# Altium schematic sheet Main.SchDoc
size A
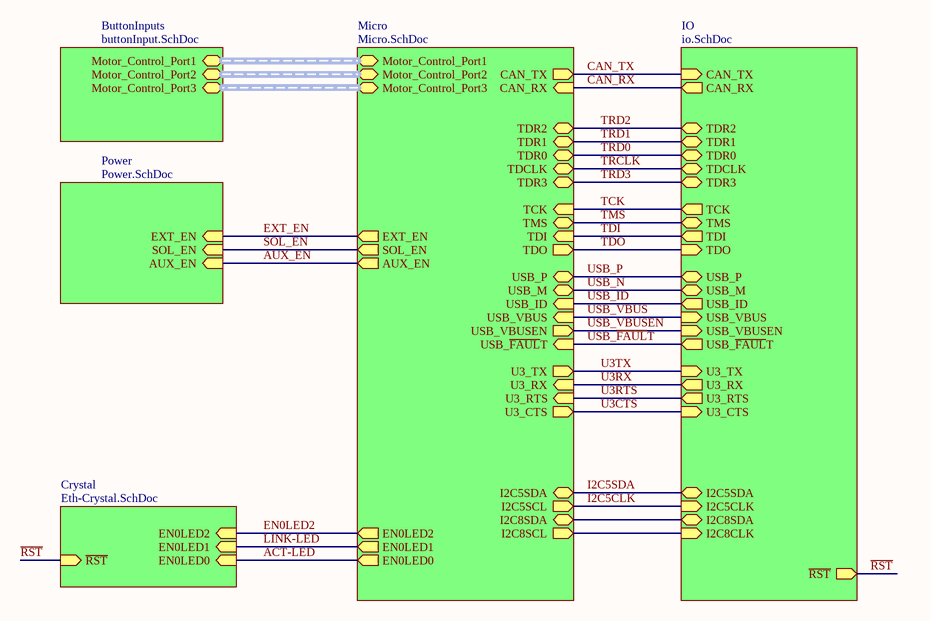
[diagram p0: Main.SchDoc]

## Sub-sheets
ButtonInputs = buttonInput.SchDoc: Motor_Control_Port1 (harness MCP), Motor_Control_Port2 (harness MCP), Motor_Control_Port3 (harness MCP)
Crystal = Eth-Crystal.SchDoc: EN0LED0 (in), EN0LED1 (in), EN0LED2 (in), ~{RST} (in)
IO = io.SchDoc: CAN_TX (in), CAN_RX (out), TCK (out), TMS (bidir), TDI (out), TDO (in), U3_RTS (out), U3_CTS (in), U3_TX (in), U3_RX (out), USB_P (bidir), USB_M (bidir), USB_ID (out), ~{RST} (out), TDR1 (bidir), TDR0 (bidir), TDR2 (bidir), TDCLK (bidir), TDR3 (bidir), I2C5SDA (bidir), I2C5CLK (in), USB_VBUSEN (in), USB_~{FAUL}T (out), I2C8CLK (in), USB_VBUS (in), I2C8SDA (bidir)
Micro = Micro.SchDoc: AUX_EN (out), CAN_TX (out), CAN_RX (in), Motor_Control_Port1 (harness MCP), Motor_Control_Port2 (harness MCP), Motor_Control_Port3 (harness MCP), TCK (in), TMS (bidir), TDI (in), TDO (out), EN0LED0 (out), EN0LED1 (out), EN0LED2 (out), USB_P (bidir), USB_M (bidir), USB_ID (in), USB_VBUS (in), U3_TX (out), U3_RX (in), U3_RTS (in), U3_CTS (out), TDR3 (bidir), TDR0 (bidir), TDCLK (bidir), TDR2 (bidir), TDR1 (bidir), I2C5SDA (bidir), I2C5SCL (out), USB_VBUSEN (out), USB_~{FAUL}T (in), EXT_EN (out), SOL_EN (out), I2C8SDA (bidir), I2C8SCL (out)
Power = Power.SchDoc: AUX_EN (in), EXT_EN (in), SOL_EN (in)

## Nets
ACT-LED: sheet Micro/EN0LED0, sheet Crystal/EN0LED0
AUX_EN: sheet Micro/AUX_EN, sheet Power/AUX_EN
CAN_RX: sheet Micro/CAN_RX, sheet IO/CAN_RX
CAN_TX: sheet Micro/CAN_TX, sheet IO/CAN_TX
EN0LED2: sheet Micro/EN0LED2, sheet Crystal/EN0LED2
EXT_EN: sheet Micro/EXT_EN, sheet Power/EXT_EN
I2C5CLK: sheet Micro/I2C5SCL, sheet IO/I2C5CLK
I2C5SDA: sheet Micro/I2C5SDA, sheet IO/I2C5SDA
LINK-LED: sheet Micro/EN0LED1, sheet Crystal/EN0LED1
~{RST}: sheet Crystal/~{RST}, sheet IO/~{RST}
SOL_EN: sheet Micro/SOL_EN, sheet Power/SOL_EN
TCK: sheet Micro/TCK, sheet IO/TCK
TDI: sheet Micro/TDI, sheet IO/TDI
TDO: sheet Micro/TDO, sheet IO/TDO
TMS: sheet Micro/TMS, sheet IO/TMS
TRCLK: sheet Micro/TDCLK, sheet IO/TDCLK
TRD0: sheet Micro/TDR0, sheet IO/TDR0
TRD1: sheet Micro/TDR1, sheet IO/TDR1
TRD2: sheet Micro/TDR2, sheet IO/TDR2
TRD3: sheet Micro/TDR3, sheet IO/TDR3
U3CTS: sheet Micro/U3_CTS, sheet IO/U3_CTS
U3RTS: sheet Micro/U3_RTS, sheet IO/U3_RTS
U3RX: sheet Micro/U3_RX, sheet IO/U3_RX
U3TX: sheet Micro/U3_TX, sheet IO/U3_TX
USB_~{FAUL}T: sheet Micro/USB_~{FAUL}T, sheet IO/USB_~{FAUL}T
USB_ID: sheet Micro/USB_ID, sheet IO/USB_ID
USB_N: sheet Micro/USB_M, sheet IO/USB_M
USB_P: sheet Micro/USB_P, sheet IO/USB_P
USB_VBUS: sheet Micro/USB_VBUS, sheet IO/USB_VBUS
USB_VBUSEN: sheet Micro/USB_VBUSEN, sheet IO/USB_VBUSEN
(unnamed): sheet Micro/I2C8SDA, sheet IO/I2C8SDA
(unnamed): sheet Micro/I2C8SCL, sheet IO/I2C8CLK

## Buses and harness runs
harness sheet ButtonInputs/Motor_Control_Port1 = sheet Micro/Motor_Control_Port1
harness sheet ButtonInputs/Motor_Control_Port2 = sheet Micro/Motor_Control_Port2
harness sheet ButtonInputs/Motor_Control_Port3 = sheet Micro/Motor_Control_Port3